# EAGLE design board (EAGLE 7.3.0)
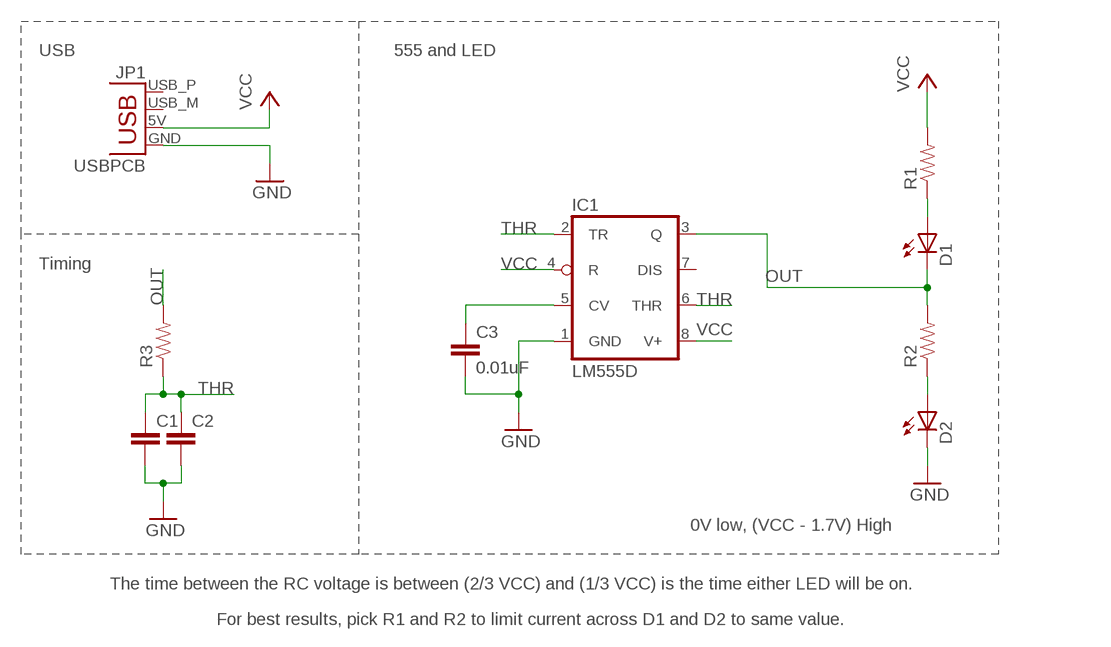
[diagram p0: schematic, sheet 1]

## Parts
C1  CAP0805  [0805]
C2  CAP0805  [0805]
C3  0.01uF  CAP0805  [0805]
D1  LEDCHIP-LED0805  [CHIP-LED0805]
D2  LEDCHIP-LED0805  [CHIP-LED0805]
IC1  LM555D  [SO08]
JP1  USBPCB  [USB-A-PCB]
R1  RESISTOR0805-RES  [0805]
R2  RESISTOR0805-RES  [0805]
R3  RESISTOR0805-RES  [0805]

## Nets
GND: C1.2 C2.2 C3.2 D2.C IC1.1(GND) JP1.GND
N$1: D1.A R1.1
N$2: C3.1 IC1.5(CV)
N$3: D2.A R2.1
OUT: D1.C IC1.3(Q) R2.2 R3.2
THR: C1.1 C2.1 IC1.2(TR) IC1.6(THR) R3.1
VCC: IC1.4(R) IC1.8(V+) JP1.5V(VBUS) R1.2
Unconnected: IC1.7(DIS) JP1.USB_M(D-) JP1.USB_P(D+)

## Notes on the sheet
- USB | 555 and LED
- Timing
- 0V low, (VCC - 1.7V) High
- The time between the RC voltage is between (2/3 VCC) and (1/3 VCC) is the time either LED will be on.
- For best results, pick R1 and R2 to limit current across D1 and D2 to same value.

## Library data of the parts
C1-C3 = SparkFun-Capacitors:CAP: Capacitor Standard 0603 ceramic capacitor, and 0.1" leaded capacitor.
D1 D2 = led:LED: LED OSRAM: - CHIPLED LG R971, LG N971, LY N971, LG Q971, LY Q971, LO R971, LY R971 LH N974, LH R974 LS Q976, LO Q976, LY Q976 LO Q996 - Hyper CHIPLED LW Q18S LB Q993, LB Q99A, LB R99A - SideLED LS A670, LO A670, LY A670, LG A670, LP A670 LB A673, LV A673, LT A673, LW A673 LH A674 LY A675 LS A676, LA A676, LO A676, LY A676, LW A676 LS A679, LY A679, LG A679 - Hyper Micro SIDELED® LS Y876, LA Y876, LO Y876, LY Y876 LT Y87S - SmartLED LW L88C, LW L88S LB L89C, LB L89S, LG L890 LS L89K, LO L89K, LY L89K LS L896, LA L896, LO L896, LY L896 - TOPLED LS T670, LO T670, LY T670, LG T670, LP T670 LSG T670, LSP T670, LSY T670, LOP T670, LYG T670 LG T671, LOG T671, LSG T671 LB T673, LV T673, LT T673, LW T673 LH T674 LS T676, LA T676, LO T676, LY T676, LB T676, LH T676, LSB T676, LW T676 LB T67C, LV T67C, LT T67C, LS T67K, LO T67K, LY T67K, LW E67C LS E67B, LA E67B, LO E67B, LY E67B, LB E67C, LV E67C, LT E67C LW T67C LS T679, LY T679, LG T679 LS T770, LO T770, LY T770, LG T770, LP T770 LB T773, LV T773, LT T773, LW T773 LH T774 LS E675, LA E675, LY E675, LS T675 LS T776, LA T776, LO T776, LY T776, LB T776 LHGB T686 LT T68C, LB T68C - Hyper Mini TOPLED® LB M676 - Mini TOPLED Santana® LG M470 LS M47K, LO M47K, LY M47K Source: http://www.osram.convergy.de LUXEON: - LUMILED® LXK2-PW12-R00, LXK2-PW12-S00, LXK2-PW14-U00, LXK2-PW14-V00 LXK2-PM12-R00, LXK2-PM12-S00, LXK2-PM14-U00 LXK2-PE12-Q00, LXK2-PE12-R00, LXK2-PE12-S00, LXK2-PE14-T00, LXK2-PE14-U00 LXK2-PB12-K00, LXK2-PB12-L00, LXK2-PB12-M00, LXK2-PB14-N00, LXK2-PB14-P00, LXK2-PB14-Q00 LXK2-PR12-L00, LXK2-PR12-M00, LXK2-PR14-Q00, LXK2-PR14-R00 LXK2-PD12-Q00, LXK2-PD12-R00, LXK2-PD12-S00 LXK2-PH12-R00, LXK2-PH12-S00 LXK2-PL12-P00, LXK2-PL12-Q00, LXK2-PL12-R00 Source: www.luxeon.com KINGBRIGHT: KA-3528ASYC Source: www.kingbright.com
IC1 = linear:*555: TIMER
JP1 = SparkFun-Connectors:USB: USB Connectors USB-B-PTH is fully proven SKU : PRT-00139/CONN-08278 USB-miniB is fully proven SKU : PRT-00587 USB-A-PCB is untested. USB-A-H is throughly reviewed, but untested. Spark Fun Electronics SKU : PRT-00437 USB-B-SMT is throughly reviewed, but untested. Needs silkscreen touching up. USB-A-S has not been used/tested USB-MB-H has not been used/tested USB-MICROB has been used. CONN-09505
R1-R3 = SparkFun-Resistors:RESISTOR: Resistor Basic schematic elements and footprints for 0603, 1206, and PTH resistors.

## Board
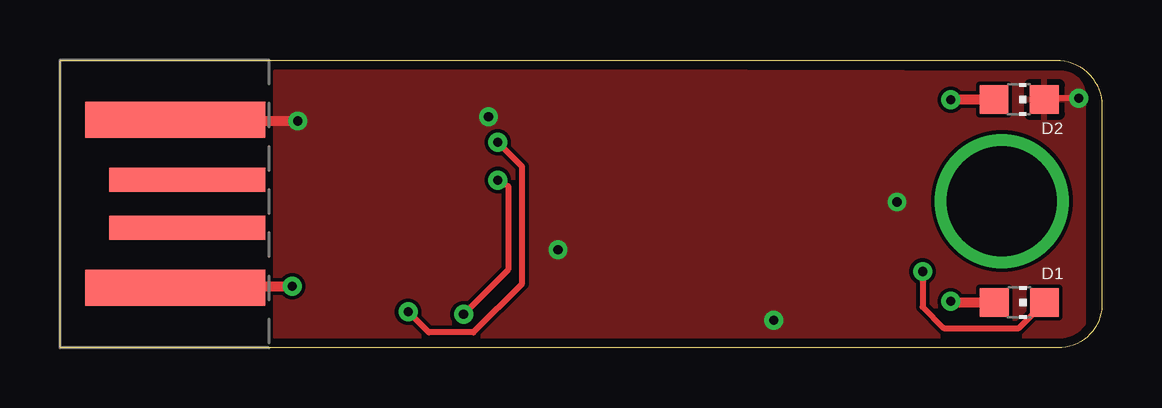
[diagram p1: board, top side]
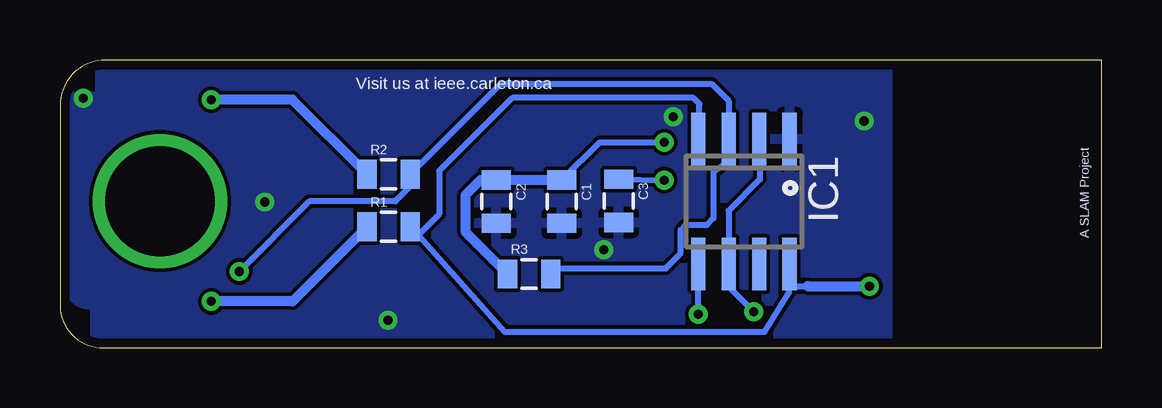
[diagram p2: board, bottom side, seen from below]

Size 43.41 x 11.99 mm. Coordinates in mm from the lower left corner, seen from the top.
Outline: 0,11.99 41.5,11.99 arc-90 43.41,10.08 43.41,1.75 arc-90 41.58,0 0,0 0,11.99
Copper layers (1*16): Top 0.035mm / dielectric 1.5mm / Bottom 0.035mm
Design rules "default *": minimum track width 6mil, minimum drill 11mil, track to track 6mil, track to pad 6mil, pad to pad 8mil, via to via 8mil, smd to smd 6mil, copper to edge 15mil, drill to drill 8mil, minimum pad ring 10mil, minimum via ring 8mil, stop-mask expansion 0mil, vias tented up to drill 25mil, thermal gap 10mil

### Footprints (pad centres in the part's own frame; a part is rotated, then mirrored left to right if it is on the bottom)
0805 = smd 0.8 x 1.2: 1 -0.9,0; 2 0.9,0
CHIP-LED0805 = smd 1.2 x 1.2: A 0,-1.05; C 0,1.05
SO08 = smd 0.6 x 2.2: 1 -1.905,-2.6; 2 -0.635,-2.6; 3 0.635,-2.6; 4 1.905,-2.6; 5 1.905,2.6; 6 0.635,2.6; 7 -0.635,2.6; 8 -1.905,2.6
USB-A-PCB = smd 7.5 x 1.5: 5V -0.2,-3.5; GND -0.2,3.5 | smd 6.5 x 1: USB_M 0.3,-1; USB_P 0.3,1

### Placement (x,y rotation side)
C1  22.5,6.09 270 bottom
C2  25.23,6.09 270 bottom
C3  20.13,6.12 270 bottom
D1  39.97,1.89 270 top
D2  39.97,10.35 270 top
IC1  14.91,6.09 180 bottom
JP1  5,5.99 0 top
R1  29.71,5.03 0 bottom
R2  29.71,7.23 0 bottom
R3  23.86,3.07 0 bottom

### Tracks (layer width: path | path; a pad name or v marks a point on that pad's centre or on a via)
GND  (via drill 0.38)
  Top 0.254: v42.44,10.39 41.06,10.39
  Top 0.406: JP1.GND 4.85,9.45 v9.91,9.45 | D2.C 41.06,10.39
  Bottom 0.152: IC1.1 13.08,8.71 13,8.71
  other vias: 29.74,1.14 34.87,6.07 17.86,9.63 20.75,4.09
  pour Bottom: 8.92,11.76 41.76,11.76 41.76,10.46 43.1,10.46 43.1,2.74 arc-90 42.16,1.8 arc90 41.96,1.6 41.96,0.48 8.92,0.48
  pour Top: 9.02,11.53 41.71,11.43 arc-90 42.62,10.52 42.62,1.18 arc-90 41.75,0.31 9.02,0.41
N$1  (via drill 0.38)
  Top 0.406: v37.11,1.93 37.15,1.89 D1.A
  Bottom 0.406: R1.1 33.72,1.93 v37.11,1.93
N$2  (via drill 0.38)
  Top 0.254: v18.24,6.99 18.67,6.73 18.67,3.25 v16.81,1.4
  Bottom 0.254: C3.1 v18.24,6.99 | 16.88,3.49 IC1.5 | 16.81,2.67 IC1.5 | v16.81,1.4 IC1.5 | IC1.5
  Bottom 0.406: C3.1 20.12,7.03
N$3  (via drill 0.38)
  Top 0.406: v37.11,10.34 37.12,10.35 D2.A
  Bottom 0.406: R2.1 33.73,10.34 v37.11,10.34
N$4  (via drill 4.57)
  other vias: 39.24,6.11
OUT  (via drill 0.38)
  Top 0.254: v35.94,3.18 35.94,1.7 36.83,0.81 39.95,0.81 D1.C
  Bottom 0.254: R3.2 22.71,3.3 18.16,3.3 17.55,3.94 17.55,4.9 17.35,5.11 16.46,5.11 16.18,5.38 16.18,7.32 16.13,7.37 15.54,7.8 IC1.3 15.54,10.29 16.26,11 25.04,11 R2.2 28.81,6.72 29.44,6.1 33.02,6.1 v35.94,3.18
THR  (via drill 0.38)
  Top 0.254: v18.24,8.56 19.25,7.54 19.25,2.67 17.22,0.64 15.37,0.64 v14.5,1.5
  Bottom 0.254: IC1.2 14.25,8.66 14.25,7.01 15.54,5.71 IC1.6 15.54,2.54 v14.5,1.5 | C1.1 20.93,8.56 v18.24,8.56 | v14.5,1.5
  Bottom 0.406: C1.1 C2.1 25.88,6.99 26.49,6.38 26.49,4.8 R3.1
VCC  (via drill 0.38)
  Top 0.406: JP1.5V 4.87,2.57 v9.68,2.57
  Bottom 0.254: R1.2 28.46,4.68 | 28.46,4.68 24.87,0.66 14.05,0.66 13.03,2.31 13.03,2.69 12.9,2.57 12.27,2.57 | IC1.4 16.76,8.74 16.76,10.16 17.02,10.41 24.56,10.41 27.61,7.37 27.61,5.56 28.46,4.71 28.46,4.68
  Bottom 0.406: IC1.8 13.03,3.46 13.03,2.69 | 12.27,2.57 v9.68,2.57

### Text on the board
bNames: Visit us at ieee.carleton.ca | A SLAM Project